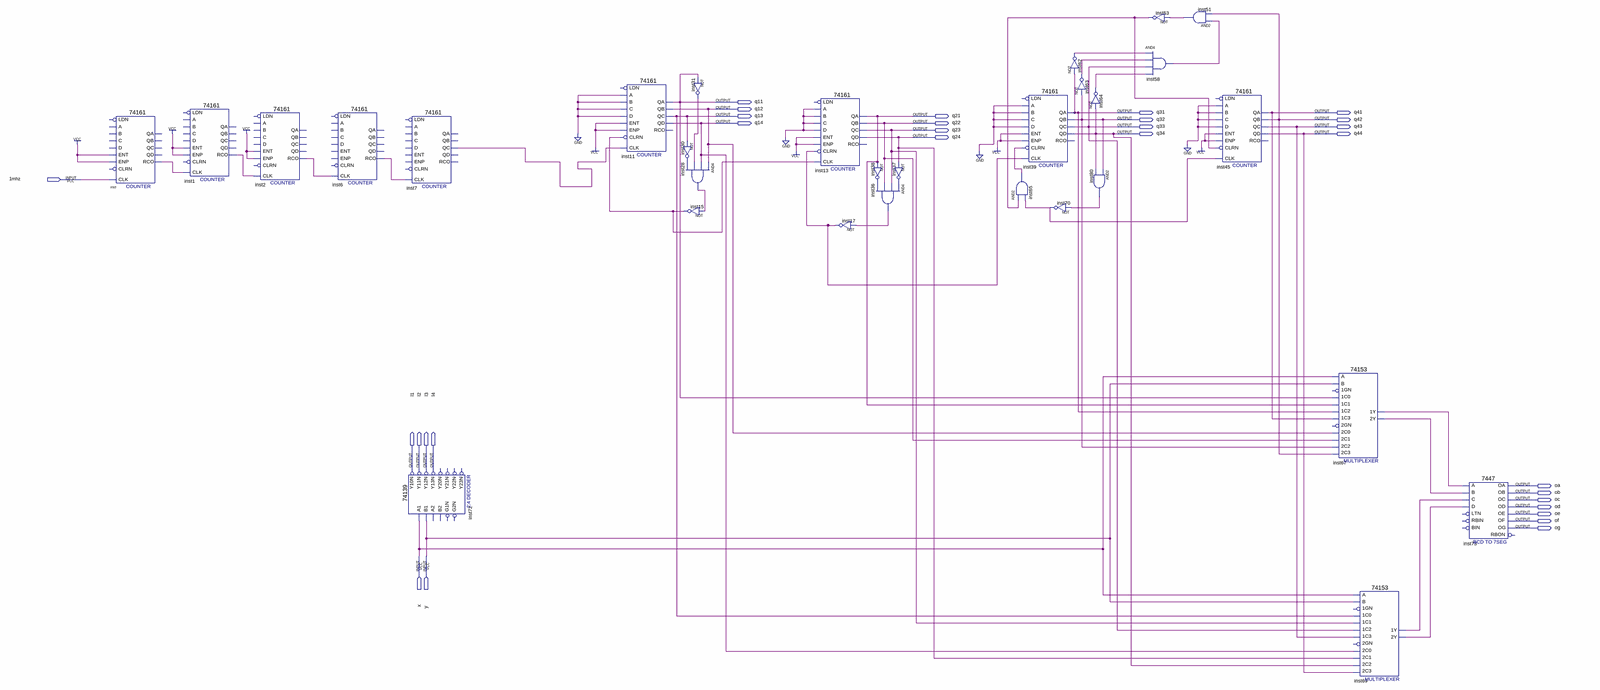
[diagram p0: schematic sheet, whole]
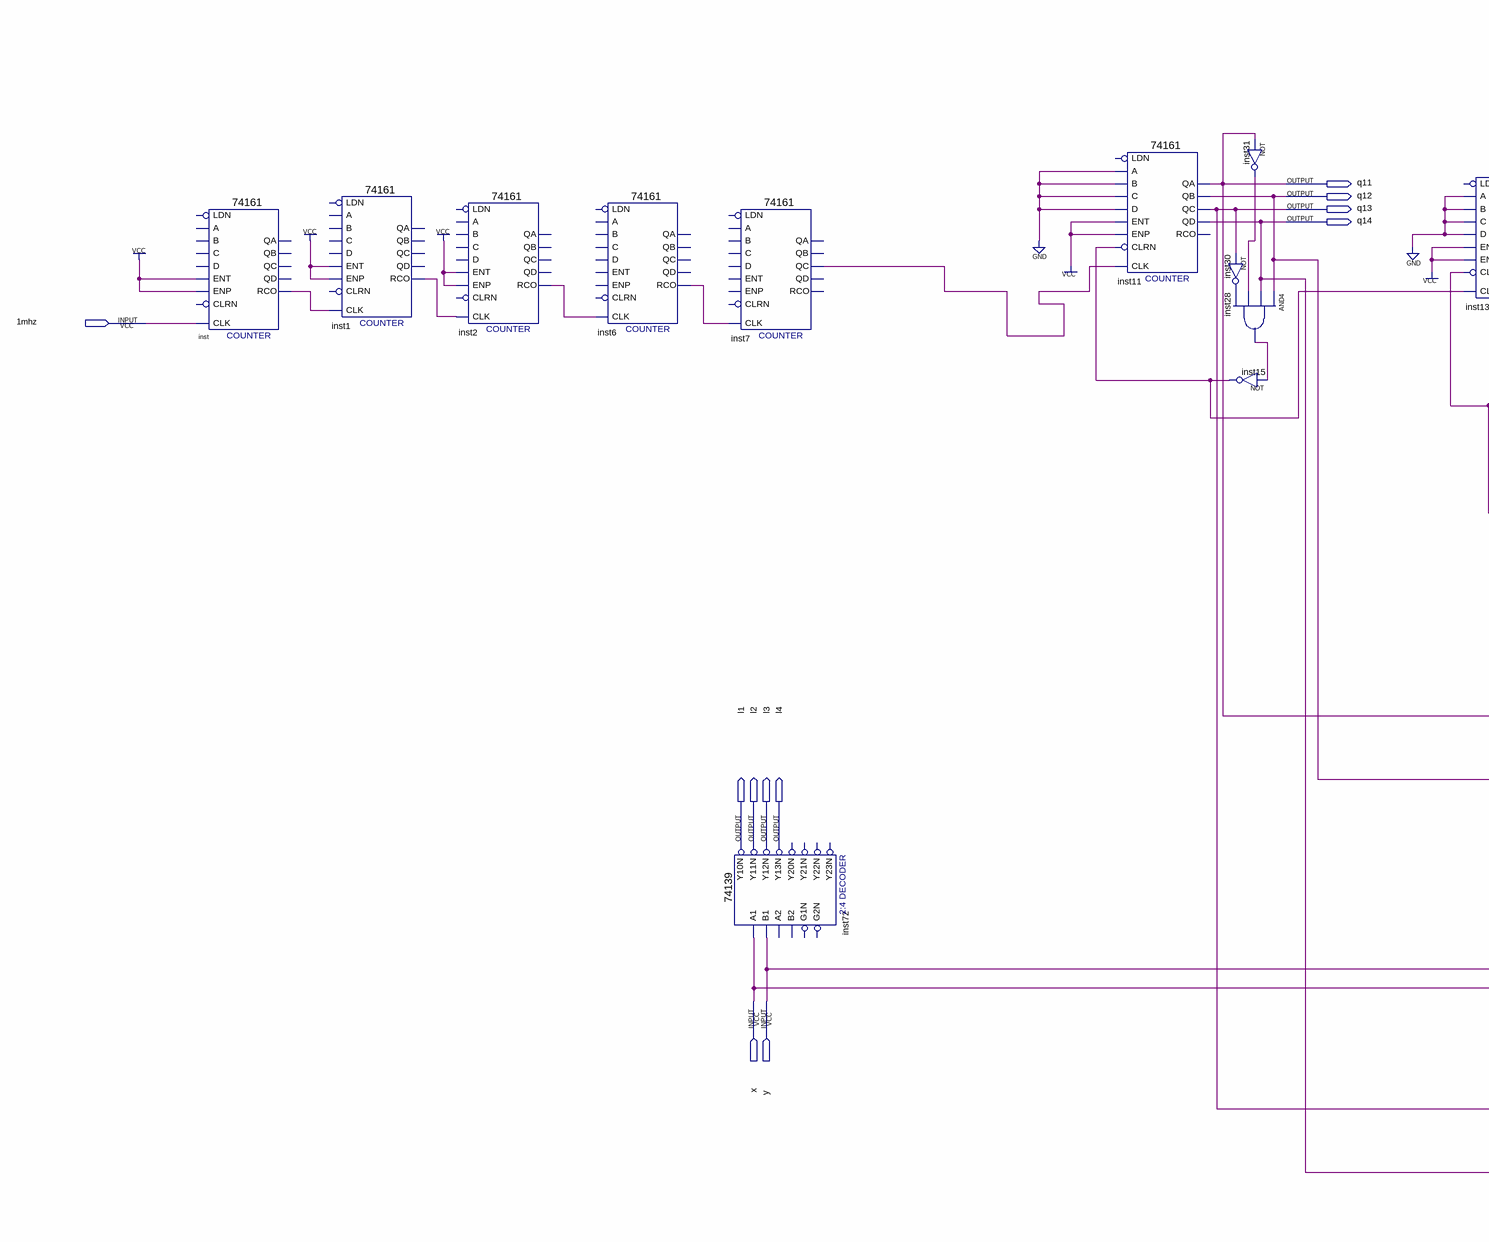
[diagram p1: schematic sheet, left part]
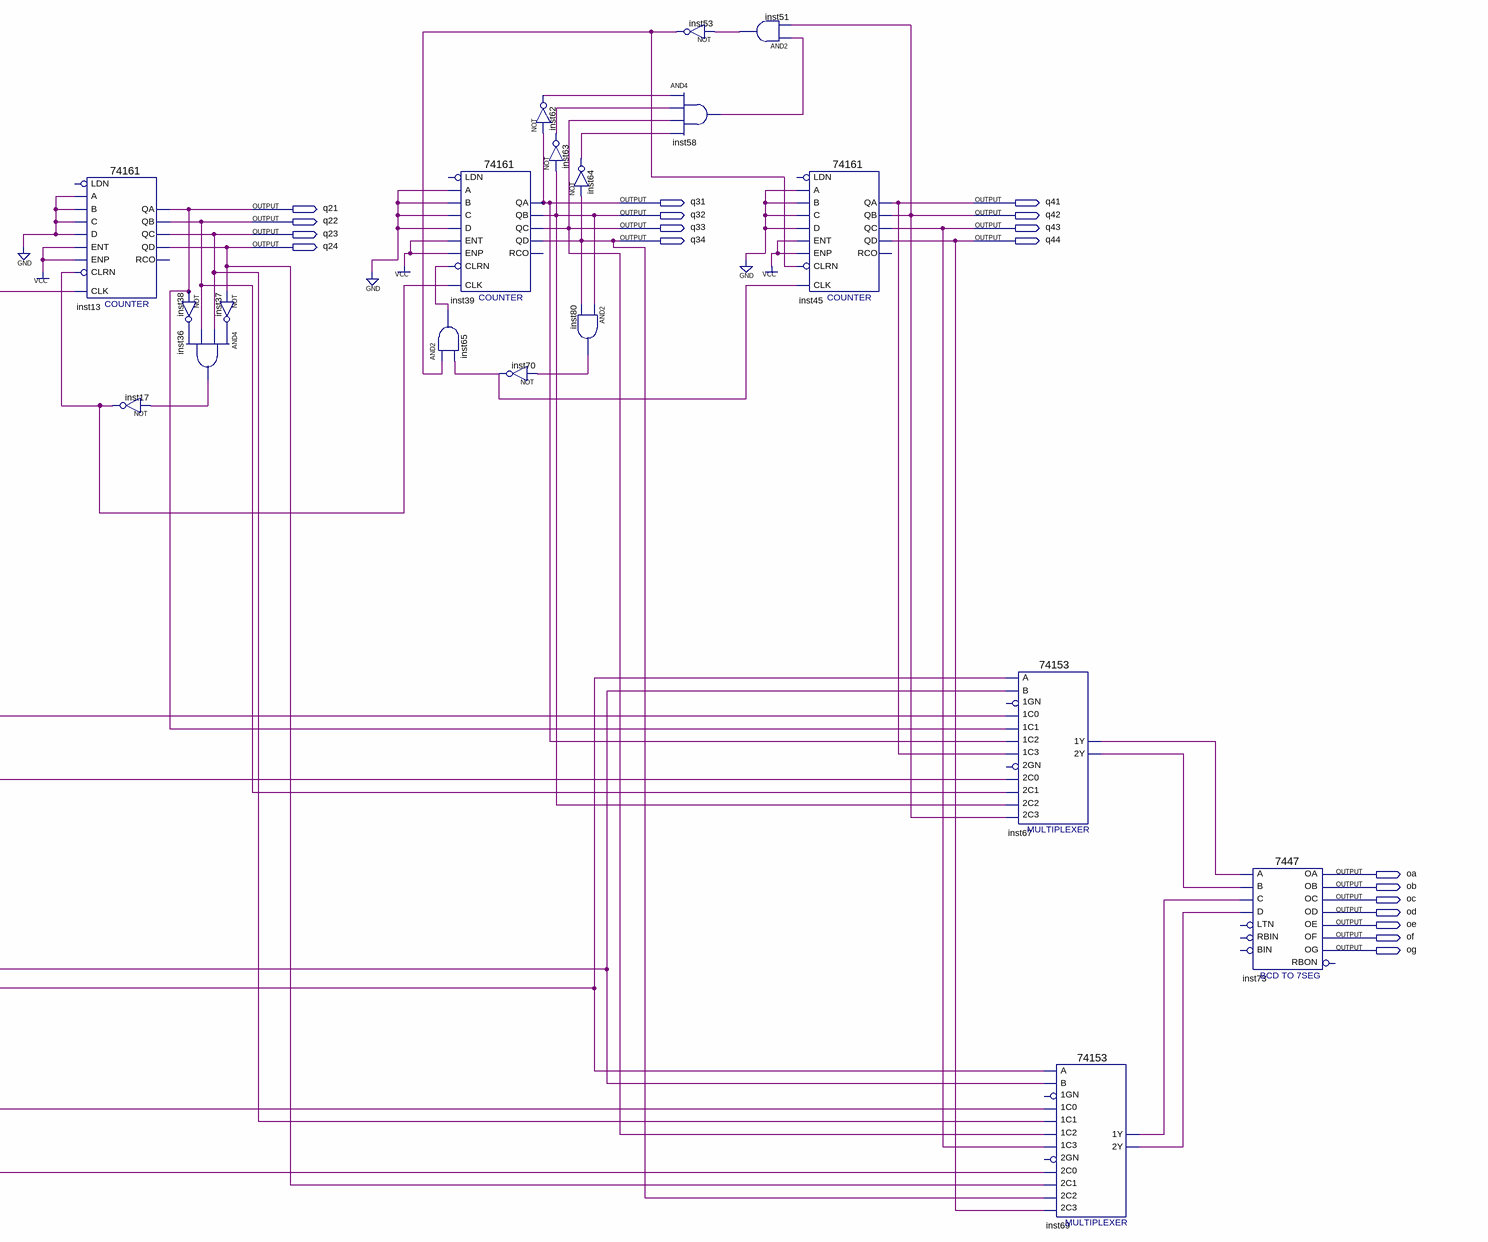
[diagram p2: schematic sheet, right part]
// Quartus schematic test.bdf as structural Verilog: 30 symbols, 30 pins
module test (
  input  \1mhz ,
  input  x,
  input  y,
  output q11,
  output q12,
  output q31,
  output q41,
  output q13,
  output q21,
  output q32,
  output q42,
  output q14,
  output q22,
  output q33,
  output q43,
  output q23,
  output q34,
  output q44,
  output q24,
  output l1,
  output l2,
  output l3,
  output l4,
  output oa,
  output ob,
  output oc,
  output od,
  output oe,
  output of,
  output og
);

  wire inst1_rco, inst2_rco, inst6_rco, inst7_qc, inst15_out, inst17_out, inst28_out, inst30_out, inst31_out,
       inst36_out, inst37_out, inst38_out, inst51_out, inst53_out, inst58_out, inst62_out, inst63_out,
       inst64_out, inst65_out, inst67_1y, inst67_2y, inst69_1y, inst69_2y, inst70_out, inst80_out, inst_rco;

  \74161  inst (.CLK(\1mhz ), .ENP(1'b1), .ENT(1'b1), .RCO(inst_rco));  // open: CLRN, LDN, A, D, B, C, QD, QC, QB, QA
  \74161  inst1 (
    .CLK(inst_rco), .ENP(1'b1), .ENT(1'b1), .RCO(inst1_rco));  // open: CLRN, LDN, A, D, B, C, QD, QC, QB, QA
  \74161  inst2 (
    .CLK(inst1_rco), .ENP(1'b1), .ENT(1'b1), .RCO(inst2_rco));  // open: CLRN, LDN, A, D, B, C, QD, QC, QB, QA
  \74161  inst6 (.CLK(inst2_rco), .RCO(inst6_rco));  // open: CLRN, ENP, LDN, A, D, ENT, B, C, QD, QC, QB, QA
  \74161  inst7 (.CLK(inst6_rco), .QC(inst7_qc));  // open: CLRN, ENP, LDN, A, D, ENT, B, C, QD, QB, QA, RCO
  \74139  inst72 (
    .A1(x), .B1(y), .Y10N(l1), .Y13N(l4), .Y12N(l3), .Y11N(l2));  // open: A2, B2, G1N, G2N, Y20N, Y21N, Y22N, Y23N
  \74161  inst11 (
    .CLRN(inst15_out), .CLK(inst7_qc), .ENP(1'b1), .A(1'b0), .D(1'b0), .ENT(1'b1), .B(1'b0), .C(1'b0),
    .QD(q14), .QC(q13), .QB(q12), .QA(q11));  // open: LDN, RCO
  not inst30 (inst30_out, q13);
  and inst28 (inst28_out, q12, q14, inst31_out, inst30_out);
  not inst15 (inst15_out, inst28_out);
  not inst31 (inst31_out, q11);
  \74161  inst13 (
    .CLRN(inst17_out), .CLK(inst15_out), .ENP(1'b1), .A(1'b0), .D(1'b0), .ENT(1'b1), .B(1'b0), .C(1'b0),
    .QD(q24), .QC(q23), .QB(q22), .QA(q21));  // open: LDN, RCO
  not inst17 (inst17_out, inst36_out);
  not inst38 (inst38_out, q21);
  and inst36 (inst36_out, inst37_out, q23, q22, inst38_out);
  not inst37 (inst37_out, q24);
  \74161  inst39 (
    .CLRN(inst65_out), .CLK(inst17_out), .ENP(1'b1), .A(1'b0), .D(1'b0), .ENT(1'b1), .B(1'b0), .C(1'b0),
    .QD(q34), .QC(q33), .QB(q32), .QA(q31));  // open: LDN, RCO
  and inst65 (inst65_out, inst53_out, inst70_out);
  not inst70 (inst70_out, inst80_out);
  not inst62 (inst62_out, q31);
  not inst63 (inst63_out, q32);
  not inst64 (inst64_out, q34);
  and inst80 (inst80_out, q32, q34);
  not inst53 (inst53_out, inst51_out);
  and inst58 (inst58_out, inst62_out, inst63_out, q33, inst64_out);
  and inst51 (inst51_out, inst58_out, q42);
  \74161  inst45 (
    .CLRN(inst53_out), .CLK(inst70_out), .ENP(1'b1), .A(1'b0), .D(1'b0), .ENT(1'b1), .B(1'b0), .C(1'b0),
    .QD(q44), .QC(q43), .QB(q42), .QA(q41));  // open: LDN, RCO
  \74153  inst67 (
    .\1C1 (q21), .\1C0 (q11), .\2C0 (q12), .\2C2 (q32), .\1C2 (q31), .\1C3 (q41), .B(y), .A(x), .\2C1 (q22),
    .\2C3 (q42), .\1Y (inst67_1y), .\2Y (inst67_2y));  // open: 1GN, 2GN
  \74153  inst69 (
    .\1C1 (q23), .\1C0 (q13), .\2C0 (q14), .\2C2 (q34), .\1C2 (q33), .\1C3 (q43), .B(y), .A(x), .\2C1 (q24),
    .\2C3 (q44), .\1Y (inst69_1y), .\2Y (inst69_2y));  // open: 1GN, 2GN
  \7447  inst73 (
    .B(inst67_2y), .C(inst69_1y), .D(inst69_2y), .A(inst67_1y), .OB(ob), .OC(oc), .OE(oe), .OD(od), .OF(of),
    .OG(og), .OA(oa));  // open: LTN, RBIN, BIN, RBON
endmodule
